# Altium schematic sheet HDMI.SchDoc
size A3; SheetNumber: 7; SheetTotal: 22
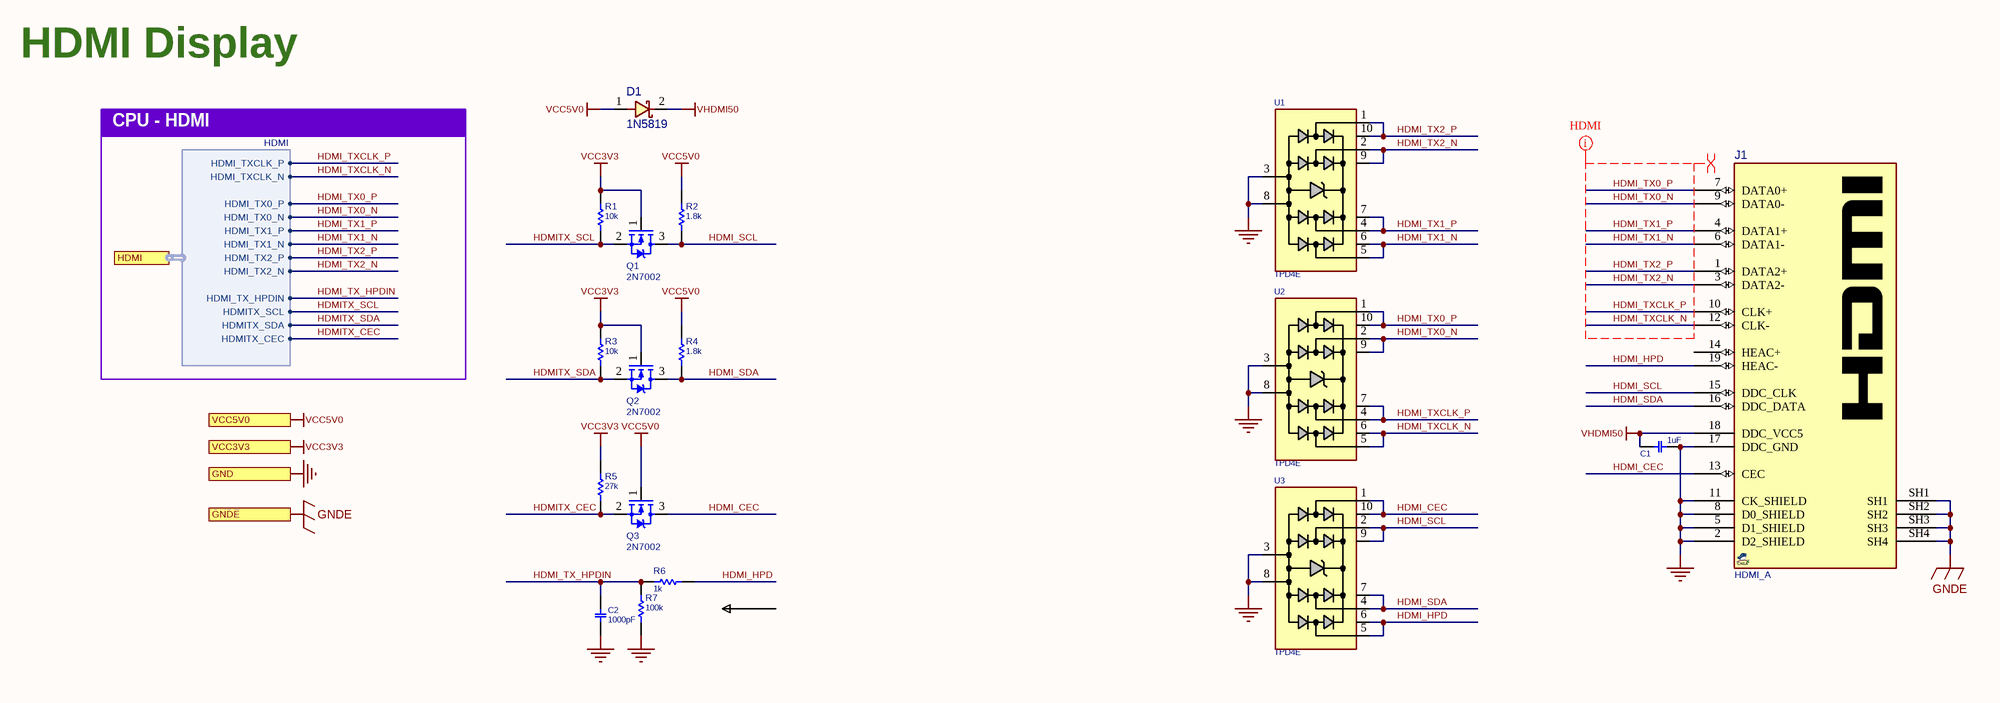
[diagram p0: HDMI.SchDoc]

## Parts
C1  1uF  [C0402]
C2  1000pF  [C0402]
D1  1N5819  [D_SOD123W]
J1  HDMI_A  [HDMI_A]
Q1  2N7002  [SOT323_3]
Q2  2N7002  [SOT323_3]
Q3  2N7002  [SOT323_3]
R1  10k  [R0402]
R2  1.8k  [R0402]
R3  10k  [R0402]
R4  1.8k  [R0402]
R5  27k  [R0402]
R6  1k  [R0402]
R7  100k  [R0402]
U1  TPD4E  [SON50_10_2510]
U2  TPD4E  [SON50_10_2510]
U3  TPD4E  [SON50_10_2510]

## Ports
GND, GNDE, HDMI (harness HDMI), VCC3V3, VCC5V0

## Harnesses
HDMI: HDMI_TXCLK_P, HDMI_TXCLK_N, HDMI_TX0_P, HDMI_TX0_N, HDMI_TX1_P, HDMI_TX1_N, HDMI_TX2_P, HDMI_TX2_N, HDMI_TX_HPDIN, HDMITX_SCL, HDMITX_SDA, HDMITX_CEC

## Nets
GND: C1.1 C2.1 J1.2(D2_SHIELD) J1.5(D1_SHIELD) J1.8(D0_SHIELD) J1.11(CK_SHIELD) J1.17(DDC_GND) R7.1 U1.3 U1.8 U2.3 U2.8 U3.3 U3.8 ; port GND
GNDE: J1.SH1 J1.SH2 J1.SH3 J1.SH4 ; port GNDE
VCC3V3: Q1.1(GATE) Q2.1(GATE) R1.1 R3.1 R5.1 ; port VCC3V3
VCC5V0: D1.1 Q3.1(GATE) R2.1 R4.1 ; port VCC5V0
VHDMI50: C1.2 D1.2 J1.18(DDC_VCC5)
HDMI_CEC: J1.13(CEC) Q3.3(DRAIN) U3.1 U3.10
HDMI_HPD: J1.19(HEAC-) R6.2 U3.5 U3.6
HDMI_SCL: J1.15(DDC_CLK) Q1.3(DRAIN) R2.2 U3.2 U3.9
HDMI_SDA: J1.16(DDC_DATA) Q2.3(DRAIN) R4.2 U3.4 U3.7
HDMI_TX0_N: J1.9(DATA0-) U2.2 U2.9 ; port HDMI.HDMI_TX0_N
HDMI_TX0_P: J1.7(DATA0+) U2.1 U2.10 ; port HDMI.HDMI_TX0_P
HDMI_TX1_N: J1.6(DATA1-) U1.5 U1.6 ; port HDMI.HDMI_TX1_N
HDMI_TX1_P: J1.4(DATA1+) U1.4 U1.7 ; port HDMI.HDMI_TX1_P
HDMI_TX2_N: J1.3(DATA2-) U1.2 U1.9 ; port HDMI.HDMI_TX2_N
HDMI_TX2_P: J1.1(DATA2+) U1.1 U1.10 ; port HDMI.HDMI_TX2_P
HDMI_TX_HPDIN: C2.2 R6.1 R7.2 ; port HDMI.HDMI_TX_HPDIN
HDMI_TXCLK_N: J1.12(CLK-) U2.5 U2.6 ; port HDMI.HDMI_TXCLK_N
HDMI_TXCLK_P: J1.10(CLK+) U2.4 U2.7 ; port HDMI.HDMI_TXCLK_P
HDMITX_CEC: Q3.2(SOURCE) R5.2 ; port HDMI.HDMITX_CEC
HDMITX_SCL: Q1.2(SOURCE) R1.2 ; port HDMI.HDMITX_SCL
HDMITX_SDA: Q2.2(SOURCE) R3.2 ; port HDMI.HDMITX_SDA

Not connected (* = marked no-connect by the designer): J1 14(HEAC+)

## Layout directives
differential pair: HDMI_TX0_N, HDMI_TX0_P, HDMI_TX1_N, HDMI_TX1_P, HDMI_TX2_N, HDMI_TX2_P, HDMI_TXCLK_N, HDMI_TXCLK_P
net class HDMI: HDMI_TX0_N, HDMI_TX0_P, HDMI_TX1_N, HDMI_TX1_P, HDMI_TX2_N, HDMI_TX2_P, HDMI_TXCLK_N, HDMI_TXCLK_P

## Notes on the sheet
- HDMI Display
- CPU - HDMI

## Library data of the parts
C1 = CAP_SMD_MLCC: CAP, MLCC; PARAM: X5R, 10%; MANF_P#: CL05A105KO5NNND; MANF: Samsung; PARAM2: 16v; PRICE: 50,000:	$0.006; ASSEMBLY: ASSEMBLY; VALUE: 1uF
C2 = CAP_SMD_MLCC: CAP, MLCC; PARAM: C0G, 5%; MANF_P#: CC0402JRNPO9BN102; MANF: Yageo; PARAM2: 50v; PRICE: 10,000:	$0.006; ASSEMBLY: ASSEMBLY; VALUE: 1000pF
D1 = DIODE_SMD_SCHOTTKY_1N5819: DIODE, SCHOTTKY, 40V, 1A; MANF: DIODES; MANF_P#: 1N5819HW-7-F; DESC: DESCRIPTION; ASSEMBLY: ASSEMBLY; PRICE: PRICE; PARAM2: 1A; PARAM: 40V; VALUE: 1N5819
J1 = CONN_HDMI_A: CONN, HDMI, Receptacle, TYPE A, 19P, RIGH-ANGLE; MANF: Molex, WURTH; MANF_P#: 208658-1051, 47151-0001, 500254-1927; PARAM: Receptacle, 19P, RIGH-ANGLE; MANF_P#2: 685119134923; PRICE: 2.57$; VALUE: HDMI_A
Q1-Q3 = MOSN_2N7002_SOT323: MOSFET, N-CH, 60V, 0.3A, SOT323; MANF_P#: 2N7002BKW, 2N7002KW, 2N7002W; PARAM: 60V, 310mA, 275mW; PARAM2: 1.6 Ohm @ 500mA, 10V; MANF: NXP Semiconductors; ASSEMBLY: ASSEMBLY; VALUE: 2N7002
R1-R7 = RES_SMD: RESISTOR, SMD; PARAM: 0.063W; DESC: DESCRIPTION; DIST#: MOUSER; PARAM2: 1%; MANF_P#: -; MANF: -; ASSEMBLY: ASSEMBLY; PRICE: 100= 0.3$
  R1 R3: VALUE: 10k
  R2 R4: VALUE: 1.8k
  R5: VALUE: 27k
  R6: VALUE: 1k
  R7: VALUE: 100k
U1-U3 = TVS_X4_TPD4E05U06: TVS, ESD PROTECT, 4CH,; MANF_P#: TPD4E05U06DQA; MANF: Texas Instruments; PARAM2: 6.5Vbr, 0.4pF, –40°~125°C; PARAM: ±12-kV ContactD, ±15-kVAirD; PRICE: 0.6$; VALUE: TPD4E